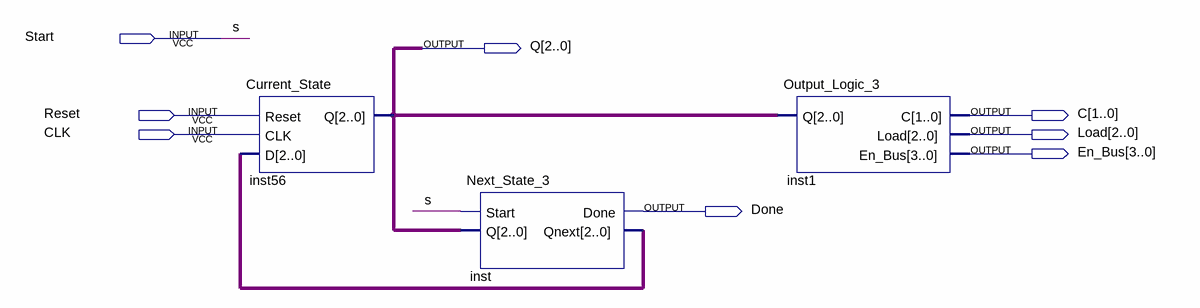
[diagram p0: schematic sheet]
// Quartus schematic Controller_3.bdf as structural Verilog: 3 symbols, 8 pins
module Controller_3 (
  input  Start,
  input  Reset,
  input  CLK,
  output [2:0] Q,
  output [1:0] C,
  output [2:0] Load,
  output [3:0] En_Bus,
  output Done
);

  wire [2:0] inst_qnext;

  Current_State inst56 (.Reset(Reset), .CLK(CLK), .D(inst_qnext), .Q(Q));
  Next_State_3 inst (.Start(Start), .Q(Q), .Done(Done), .Qnext(inst_qnext));
  Output_Logic_3 inst1 (.Q(Q), .C(C), .Load(Load), .En_Bus(En_Bus));

  // Other names for the same wires on the sheet: s = Start
endmodule
